# Altium project PCB_BobBreakout.PrjPcb
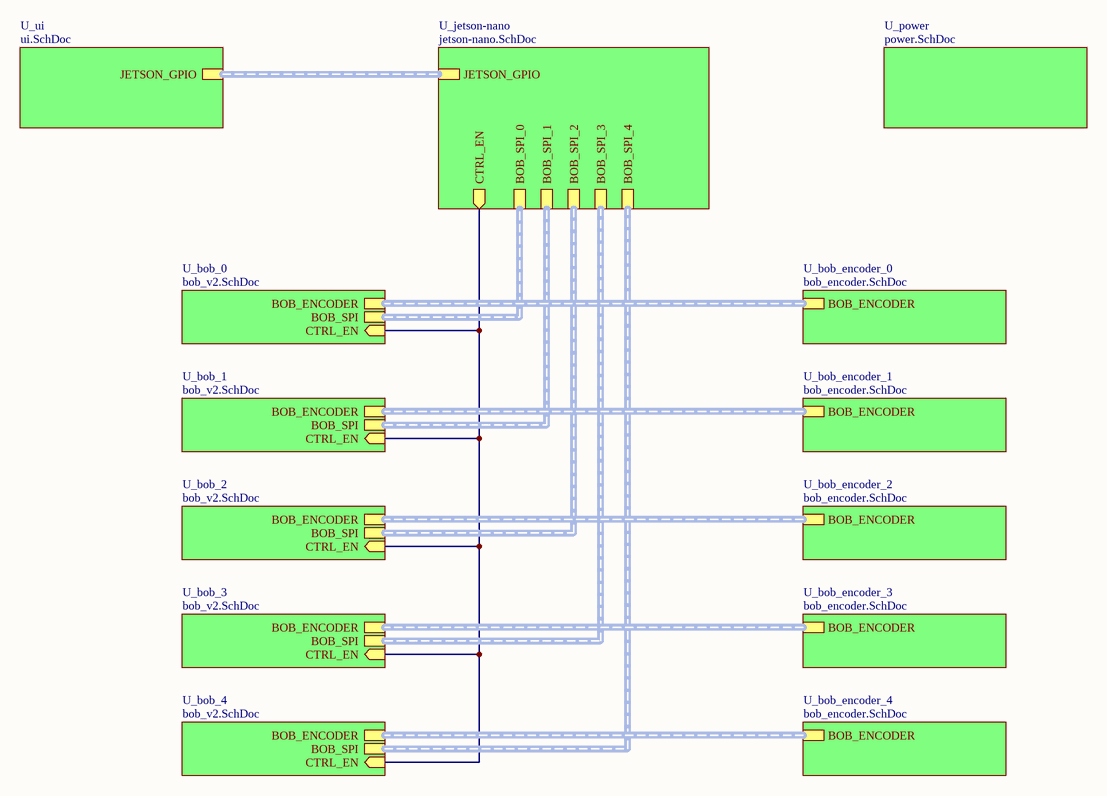
[diagram p0: bob_breakout-top.SchDoc]
8 sheets, 106 parts. Net scope: hierarchical (ports join the sheet entries above them; power ports are global).
Board file: bob_breakout-layout.PcbDoc
Sheets:
  bob_breakout-top.SchDoc
    U_jetson-nano = jetson-nano.SchDoc
      U_isolation_0 = isolation.SchDoc
      U_isolation_1 = isolation.SchDoc
      U_isolation_2 = isolation.SchDoc
      U_low-pass-filter_0 = low-pass-filter.SchDoc
      U_low-pass-filter_1 = low-pass-filter.SchDoc
      U_low-pass-filter_2 = low-pass-filter.SchDoc
      U_low-pass-filter_3 = low-pass-filter.SchDoc
      U_low-pass-filter_4 = low-pass-filter.SchDoc
      U_low-pass-filter_5 = low-pass-filter.SchDoc
      U_low-pass-filter_6 = low-pass-filter.SchDoc
      U_low-pass-filter_7 = low-pass-filter.SchDoc
      U_low-pass-filter_8 = low-pass-filter.SchDoc
      U_low-pass-filter_9 = low-pass-filter.SchDoc
    U_bob_0 = bob_v2.SchDoc
    U_bob_1 = bob_v2.SchDoc
    U_bob_2 = bob_v2.SchDoc
    U_bob_3 = bob_v2.SchDoc
    U_bob_4 = bob_v2.SchDoc
    U_power = power.SchDoc
    U_ui = ui.SchDoc
    U_bob_encoder_0 = bob_encoder.SchDoc
    U_bob_encoder_1 = bob_encoder.SchDoc
    U_bob_encoder_2 = bob_encoder.SchDoc
    U_bob_encoder_3 = bob_encoder.SchDoc
    U_bob_encoder_4 = bob_encoder.SchDoc

## Sheet bob_breakout-top.SchDoc
size A4; SheetNumber: 1; SheetTotal: 8

### Sub-sheets
U_bob_0 = bob_v2.SchDoc: BOB_SPI (harness BOB_SPI), CTRL_EN (in), BOB_ENCODER
U_bob_1 = bob_v2.SchDoc: BOB_SPI (harness BOB_SPI), CTRL_EN (in), BOB_ENCODER
U_bob_2 = bob_v2.SchDoc: BOB_SPI (harness BOB_SPI), CTRL_EN (in), BOB_ENCODER
U_bob_3 = bob_v2.SchDoc: BOB_SPI (harness BOB_SPI), CTRL_EN (in), BOB_ENCODER
U_bob_4 = bob_v2.SchDoc: BOB_SPI (harness BOB_SPI), CTRL_EN (in), BOB_ENCODER
U_bob_encoder_0 = bob_encoder.SchDoc: BOB_ENCODER
U_bob_encoder_1 = bob_encoder.SchDoc: BOB_ENCODER
U_bob_encoder_2 = bob_encoder.SchDoc: BOB_ENCODER
U_bob_encoder_3 = bob_encoder.SchDoc: BOB_ENCODER
U_bob_encoder_4 = bob_encoder.SchDoc: BOB_ENCODER
U_jetson-nano = jetson-nano.SchDoc: BOB_SPI_2 (harness BOB_SPI), BOB_SPI_0 (harness BOB_SPI), BOB_SPI_4 (harness BOB_SPI), BOB_SPI_3 (harness BOB_SPI), BOB_SPI_1 (harness BOB_SPI), JETSON_GPIO (harness JETSON_GPIO), CTRL_EN (out)
U_power = power.SchDoc: no entries
U_ui = ui.SchDoc: JETSON_GPIO (harness JETSON_GPIO)

### Nets
CTRL_EN: sheet U_jetson-nano/CTRL_EN, sheet U_bob_0/CTRL_EN, sheet U_bob_1/CTRL_EN, sheet U_bob_2/CTRL_EN, sheet U_bob_3/CTRL_EN, sheet U_bob_4/CTRL_EN

### Buses and harness runs
harness sheet U_bob_0/BOB_ENCODER = sheet U_bob_encoder_0/BOB_ENCODER
harness sheet U_bob_0/BOB_SPI = sheet U_jetson-nano/BOB_SPI_0
harness sheet U_bob_1/BOB_ENCODER = sheet U_bob_encoder_1/BOB_ENCODER
harness sheet U_bob_1/BOB_SPI = sheet U_jetson-nano/BOB_SPI_1
harness sheet U_bob_2/BOB_ENCODER = sheet U_bob_encoder_2/BOB_ENCODER
harness sheet U_bob_2/BOB_SPI = sheet U_jetson-nano/BOB_SPI_2
harness sheet U_bob_3/BOB_ENCODER = sheet U_bob_encoder_3/BOB_ENCODER
harness sheet U_bob_3/BOB_SPI = sheet U_jetson-nano/BOB_SPI_3
harness sheet U_bob_4/BOB_ENCODER = sheet U_bob_encoder_4/BOB_ENCODER
harness sheet U_bob_4/BOB_SPI = sheet U_jetson-nano/BOB_SPI_4
harness sheet U_jetson-nano/JETSON_GPIO = sheet U_ui/JETSON_GPIO

## Sheet jetson-nano.SchDoc
size A3; SheetNumber: 2; SheetTotal: 8
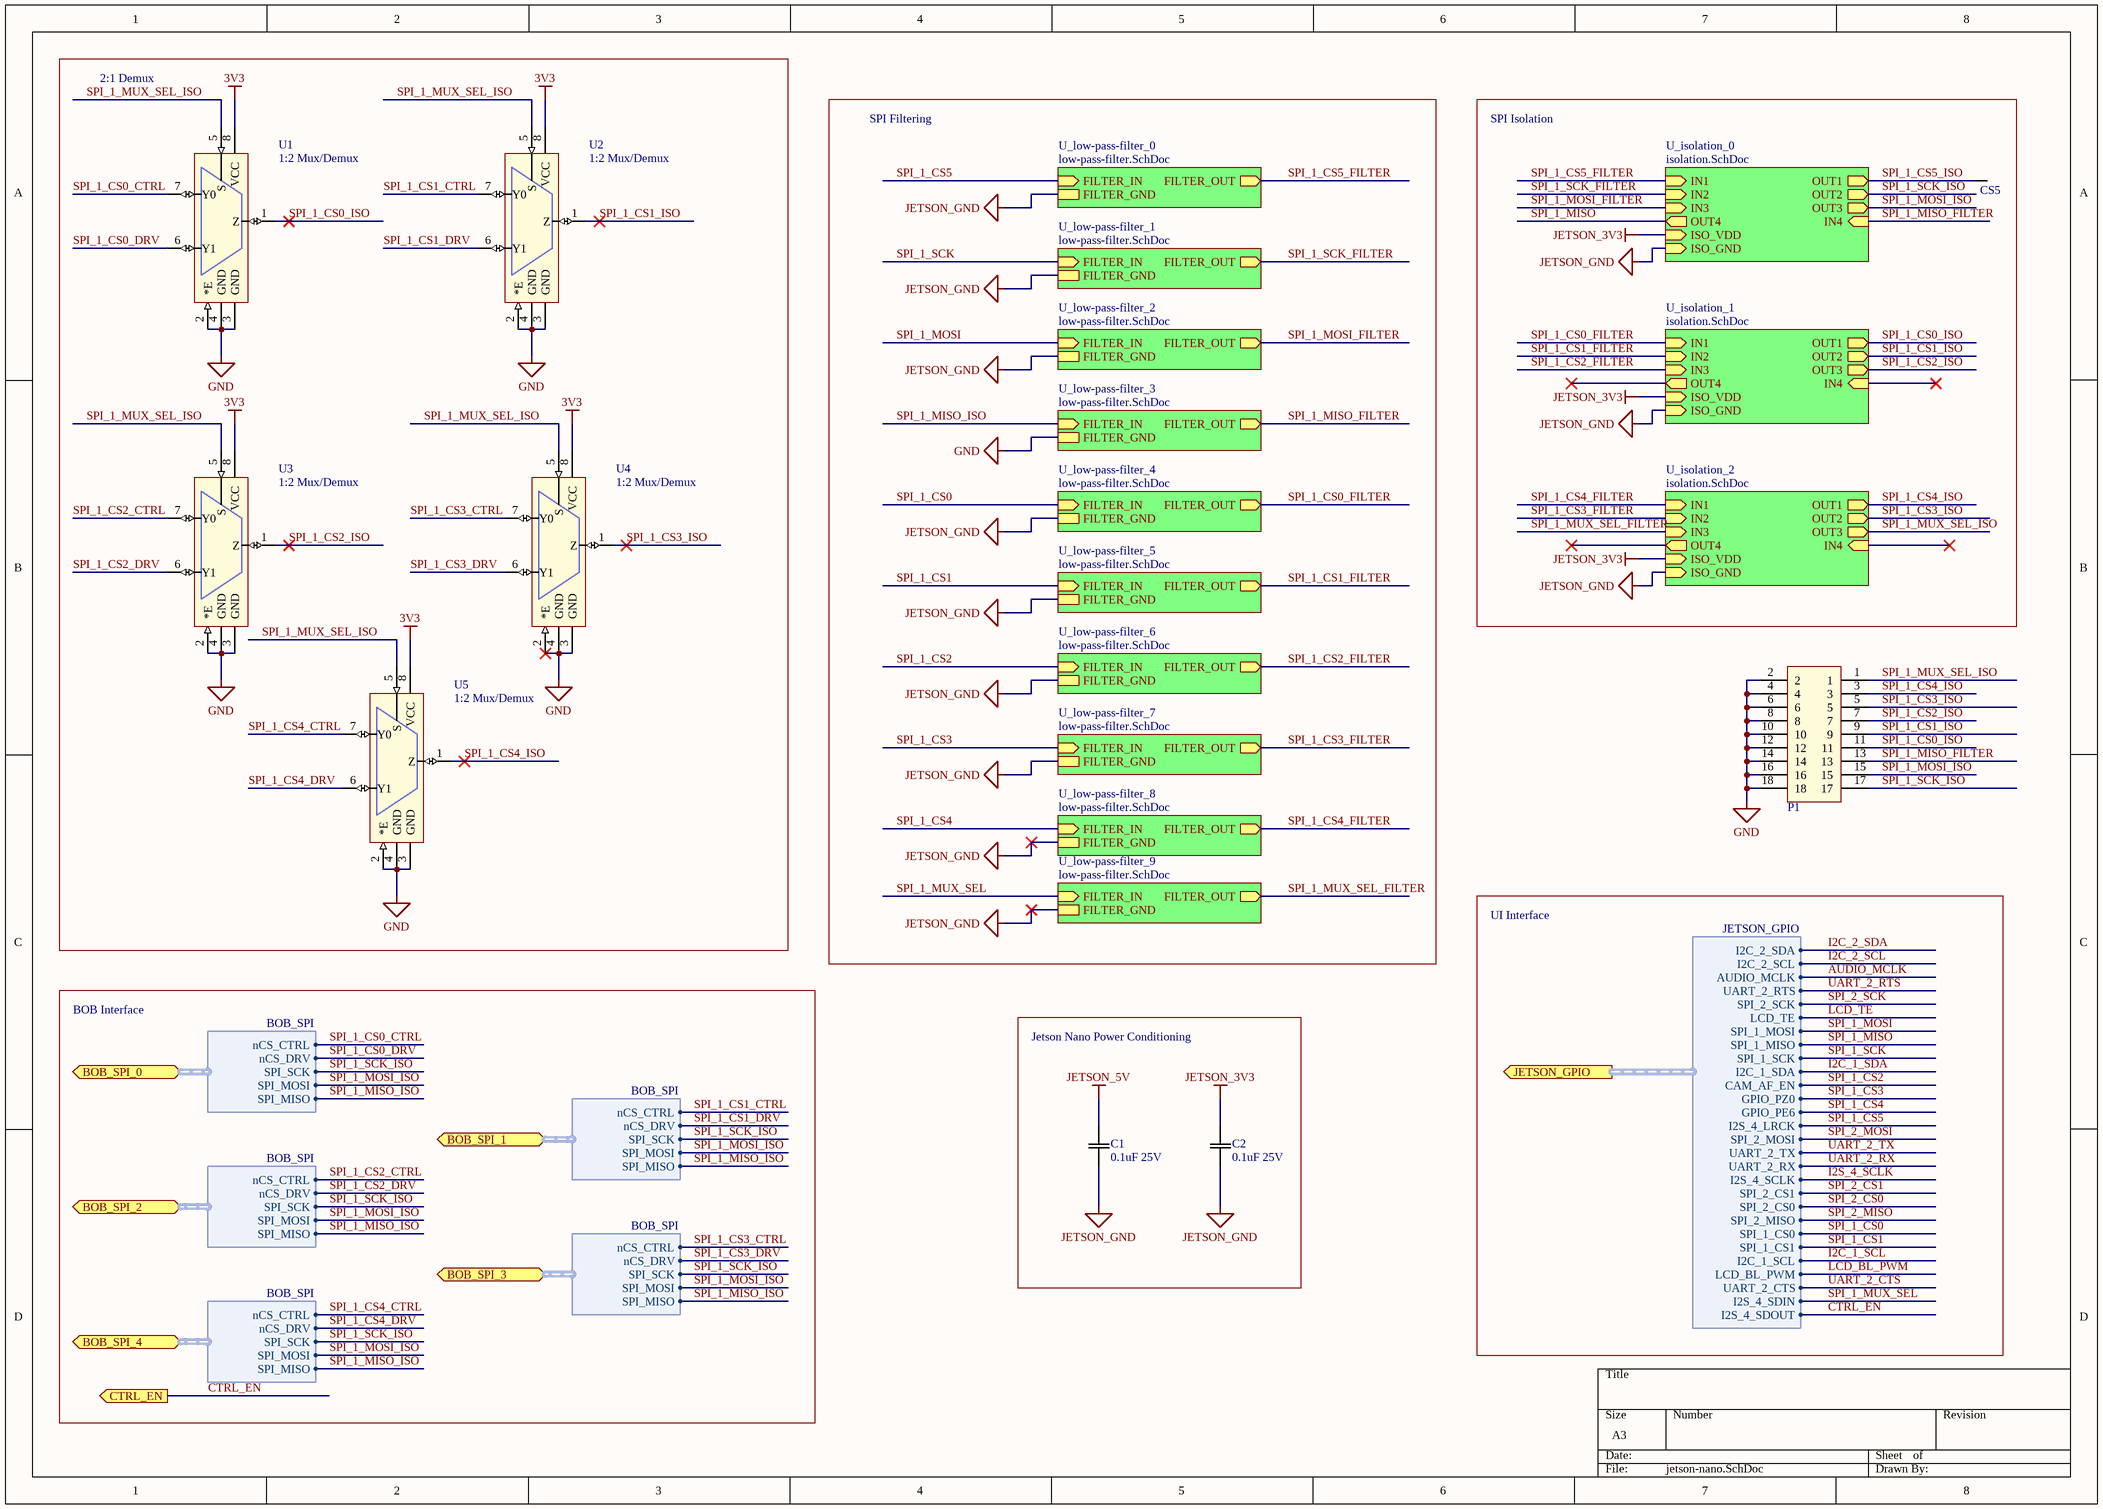
[diagram p1: jetson-nano.SchDoc]

### Parts
C1  0.1uF 25V  [0805]
C2  0.1uF 25V  [0805]
CS5  Test Point (Via)  [TP]  (value not drawn)
P1  CN HDR 18POS 2x9  [HDR2x9]  (value not drawn)
U1  1:2 Mux/Demux  [TSOP65P400X110-8N]
U2  1:2 Mux/Demux  [TSOP65P400X110-8N]
U3  1:2 Mux/Demux  [TSOP65P400X110-8N]
U4  1:2 Mux/Demux  [TSOP65P400X110-8N]
U5  1:2 Mux/Demux  [TSOP65P400X110-8N]

### Blocks framed on the sheet
2:1 Demux: U1-U5
SPI Isolation: CS5
Jetson Nano Power Conditioning: C1 C2

### Sub-sheets
U_isolation_0 = isolation.SchDoc: OUT1 (out), IN1 (in), IN2 (in), IN3 (in), OUT4 (out), OUT3 (out), OUT2 (out), IN4 (in), ISO_VDD (in), ISO_GND (in)
U_isolation_1 = isolation.SchDoc: OUT1 (out), IN1 (in), IN2 (in), IN3 (in), OUT4 (out), OUT3 (out), OUT2 (out), IN4 (in), ISO_VDD (in), ISO_GND (in)
U_isolation_2 = isolation.SchDoc: OUT1 (out), IN1 (in), IN2 (in), IN3 (in), OUT4 (out), OUT3 (out), OUT2 (out), IN4 (in), ISO_VDD (in), ISO_GND (in)
U_low-pass-filter_0 = low-pass-filter.SchDoc: FILTER_OUT (out), FILTER_IN (in), FILTER_GND
U_low-pass-filter_1 = low-pass-filter.SchDoc: FILTER_OUT (out), FILTER_IN (in), FILTER_GND
U_low-pass-filter_2 = low-pass-filter.SchDoc: FILTER_OUT (out), FILTER_IN (in), FILTER_GND
U_low-pass-filter_3 = low-pass-filter.SchDoc: FILTER_OUT (out), FILTER_IN (in), FILTER_GND
U_low-pass-filter_4 = low-pass-filter.SchDoc: FILTER_OUT (out), FILTER_IN (in), FILTER_GND
U_low-pass-filter_5 = low-pass-filter.SchDoc: FILTER_OUT (out), FILTER_IN (in), FILTER_GND
U_low-pass-filter_6 = low-pass-filter.SchDoc: FILTER_OUT (out), FILTER_IN (in), FILTER_GND
U_low-pass-filter_7 = low-pass-filter.SchDoc: FILTER_OUT (out), FILTER_IN (in), FILTER_GND
U_low-pass-filter_8 = low-pass-filter.SchDoc: FILTER_OUT (out), FILTER_IN (in), FILTER_GND
U_low-pass-filter_9 = low-pass-filter.SchDoc: FILTER_OUT (out), FILTER_IN (in), FILTER_GND

### Ports
BOB_SPI_0 (bidir, harness BOB_SPI), BOB_SPI_1 (bidir, harness BOB_SPI), BOB_SPI_2 (bidir, harness BOB_SPI), BOB_SPI_3 (bidir, harness BOB_SPI), BOB_SPI_4 (bidir, harness BOB_SPI), CTRL_EN (out), JETSON_GPIO (out, harness JETSON_GPIO)

### Harnesses
BOB_SPI: nCS_CTRL, nCS_DRV, SPI_SCK, SPI_MOSI, SPI_MISO
JETSON_GPIO: I2C_2_SDA, I2C_2_SCL, AUDIO_MCLK, UART_2_RTS, SPI_2_SCK, LCD_TE, SPI_1_MOSI, SPI_1_MISO, SPI_1_SCK, I2C_1_SDA, CAM_AF_EN, GPIO_PZ0, GPIO_PE6, I2S_4_LRCK, SPI_2_MOSI, UART_2_TX, UART_2_RX, I2S_4_SCLK, SPI_2_CS1, SPI_2_CS0, SPI_2_MISO, SPI_1_CS0, SPI_1_CS1, I2C_1_SCL, LCD_BL_PWM, UART_2_CTS, I2S_4_SDIN, I2S_4_SDOUT

### Nets
3V3: U1.8(VCC) U2.8(VCC) U3.8(VCC) U4.8(VCC) U5.8(VCC)
GND: P1.2 P1.4 P1.6 P1.8 P1.10 P1.12 P1.14 P1.16 P1.18 U1.2(*E) U1.3(GND) U1.4(GND) U2.2(*E) U2.3(GND) U2.4(GND) U3.2(*E) U3.3(GND) U3.4(GND) U4.2(*E) U4.3(GND) U4.4(GND) U5.2(*E) U5.3(GND) U5.4(GND) ; sheet U_low-pass-filter_3/FILTER_GND
JETSON_3V3: C2.1(C1) ; sheet U_isolation_0/ISO_VDD, sheet U_isolation_1/ISO_VDD, sheet U_isolation_2/ISO_VDD
JETSON_5V: C1.1(C1)
JETSON_GND: C1.2(C2) C2.2(C2) ; sheet U_isolation_0/ISO_GND, sheet U_isolation_1/ISO_GND, sheet U_isolation_2/ISO_GND, sheet U_low-pass-filter_0/FILTER_GND, sheet U_low-pass-filter_1/FILTER_GND, sheet U_low-pass-filter_2/FILTER_GND, sheet U_low-pass-filter_4/FILTER_GND, sheet U_low-pass-filter_5/FILTER_GND, sheet U_low-pass-filter_6/FILTER_GND, sheet U_low-pass-filter_7/FILTER_GND, sheet U_low-pass-filter_8/FILTER_GND, sheet U_low-pass-filter_9/FILTER_GND
CTRL_EN: port CTRL_EN, port JETSON_GPIO.I2S_4_SDOUT
SPI_1_CS0: sheet U_low-pass-filter_4/FILTER_IN, port JETSON_GPIO.SPI_1_CS0
SPI_1_CS0_CTRL: U1.7(Y0) ; port BOB_SPI_0.nCS_CTRL
SPI_1_CS0_DRV: U1.6(Y1) ; port BOB_SPI_0.nCS_DRV
SPI_1_CS0_FILTER: sheet U_isolation_1/IN1, sheet U_low-pass-filter_4/FILTER_OUT
SPI_1_CS0_ISO: P1.11 U1.1(Z) ; sheet U_isolation_1/OUT1
SPI_1_CS1: sheet U_low-pass-filter_5/FILTER_IN, port JETSON_GPIO.SPI_1_CS1
SPI_1_CS1_CTRL: U2.7(Y0) ; port BOB_SPI_1.nCS_CTRL
SPI_1_CS1_DRV: U2.6(Y1) ; port BOB_SPI_1.nCS_DRV
SPI_1_CS1_FILTER: sheet U_isolation_1/IN2, sheet U_low-pass-filter_5/FILTER_OUT
SPI_1_CS1_ISO: P1.9 U2.1(Z) ; sheet U_isolation_1/OUT2
SPI_1_CS2: sheet U_low-pass-filter_6/FILTER_IN, port JETSON_GPIO.CAM_AF_EN  [project net CAM_AF_EN]
SPI_1_CS2_CTRL: U3.7(Y0) ; port BOB_SPI_2.nCS_CTRL
SPI_1_CS2_DRV: U3.6(Y1) ; port BOB_SPI_2.nCS_DRV
SPI_1_CS2_FILTER: sheet U_isolation_1/IN3, sheet U_low-pass-filter_6/FILTER_OUT
SPI_1_CS2_ISO: P1.7 U3.1(Z) ; sheet U_isolation_1/OUT3
SPI_1_CS3: sheet U_low-pass-filter_7/FILTER_IN, port JETSON_GPIO.GPIO_PZ0  [project net GPIO_PZ0]
SPI_1_CS3_CTRL: U4.7(Y0) ; port BOB_SPI_3.nCS_CTRL
SPI_1_CS3_DRV: U4.6(Y1) ; port BOB_SPI_3.nCS_DRV
SPI_1_CS3_FILTER: sheet U_isolation_2/IN2, sheet U_low-pass-filter_7/FILTER_OUT
SPI_1_CS3_ISO: P1.5 U4.1(Z) ; sheet U_isolation_2/OUT2
SPI_1_CS4: sheet U_low-pass-filter_8/FILTER_IN, port JETSON_GPIO.GPIO_PE6  [project net GPIO_PE6]
SPI_1_CS4_CTRL: U5.7(Y0) ; port BOB_SPI_4.nCS_CTRL
SPI_1_CS4_DRV: U5.6(Y1) ; port BOB_SPI_4.nCS_DRV
SPI_1_CS4_FILTER: sheet U_isolation_2/IN1, sheet U_low-pass-filter_8/FILTER_OUT
SPI_1_CS4_ISO: P1.3 U5.1(Z) ; sheet U_isolation_2/OUT1
SPI_1_CS5: sheet U_low-pass-filter_0/FILTER_IN, port JETSON_GPIO.I2S_4_LRCK  [project net I2S_4_LRCK]
SPI_1_CS5_FILTER: sheet U_isolation_0/IN1, sheet U_low-pass-filter_0/FILTER_OUT
SPI_1_CS5_ISO: CS5.1 ; sheet U_isolation_0/OUT1
SPI_1_MISO: sheet U_isolation_0/OUT4, port JETSON_GPIO.SPI_1_MISO
SPI_1_MISO_FILTER: P1.13 ; sheet U_isolation_0/IN4, sheet U_low-pass-filter_3/FILTER_OUT
SPI_1_MISO_ISO: sheet U_low-pass-filter_3/FILTER_IN, port BOB_SPI_0.SPI_MISO, port BOB_SPI_2.SPI_MISO, port BOB_SPI_1.SPI_MISO, port BOB_SPI_3.SPI_MISO, port BOB_SPI_4.SPI_MISO
SPI_1_MOSI: sheet U_low-pass-filter_2/FILTER_IN, port JETSON_GPIO.SPI_1_MOSI
SPI_1_MOSI_FILTER: sheet U_isolation_0/IN3, sheet U_low-pass-filter_2/FILTER_OUT
SPI_1_MOSI_ISO: P1.15 ; sheet U_isolation_0/OUT3, port BOB_SPI_0.SPI_MOSI, port BOB_SPI_2.SPI_MOSI, port BOB_SPI_1.SPI_MOSI, port BOB_SPI_3.SPI_MOSI, port BOB_SPI_4.SPI_MOSI
SPI_1_MUX_SEL: sheet U_low-pass-filter_9/FILTER_IN, port JETSON_GPIO.I2S_4_SDIN  [project net I2S_4_SDIN]
SPI_1_MUX_SEL_FILTER: sheet U_isolation_2/IN3, sheet U_low-pass-filter_9/FILTER_OUT
SPI_1_MUX_SEL_ISO: P1.1 U1.5(S) U2.5(S) U3.5(S) U4.5(S) U5.5(S) ; sheet U_isolation_2/OUT3
SPI_1_SCK: sheet U_low-pass-filter_1/FILTER_IN, port JETSON_GPIO.SPI_1_SCK
SPI_1_SCK_FILTER: sheet U_isolation_0/IN2, sheet U_low-pass-filter_1/FILTER_OUT
SPI_1_SCK_ISO: P1.17 ; sheet U_isolation_0/OUT2, port BOB_SPI_0.SPI_SCK, port BOB_SPI_2.SPI_SCK, port BOB_SPI_1.SPI_SCK, port BOB_SPI_3.SPI_SCK, port BOB_SPI_4.SPI_SCK

### Notes on the sheet
- SPI Filtering
- UI Interface
- BOB Interface

### Library data of the parts
C1 C2 = CAP 0.1uF 25V: CAP CER 0.1UF 25V X7R 0805/0603; Tolerance: 10%; Value: 0.1uF; Temperature Coefficient: X7R; Rating: 25V; Operating Temperature: -55°C ~ 125°C
U1-U5 = 74LVC1G53DP,125: 74LVC Series 5.5 V SMT 2-Channel Analog Multiplexer/Demultiplexer - TSSOP-8; Manufacturer: NXP Semiconductors; Min Supply Voltage: 1.65V; Max Supply Voltage: 5.5V; Number of Channels: 2; Bandwidth: 300MHz; Propagation Delay: 0.8ns; Max Power Dissipation: 250mW; On-State Resistance: 15R; Turn-On Delay Time: 6.7ns; Turn-Off Delay Time: 6.8ns; Operating Supply Current: 40uA; Number of Outputs: 1; Logic Function: Multiplexer,Demultiplexer,Mux,Demux; Supply Type: Single; Supplier 1: Digi-Key; Manufacturer Part Number: 74LVC1G53DP,125; RoHS: Yes; Category: Decoders and Multiplexers; Mount: Surface Mount; Case/Package: TSSOP; Number of Pins: 8; Min Operating Temperature: -40°C; Max Operating Temperature: 125°C; Packaging: Tape and Reel; Package Quantity: 3000; Number of Inputs: 2; Power Dissipation: 250mW; Number of Circuits: 1; Number of Switches: 1; Series: 74LVC; Number of Functions: 1; Supply Voltage-Nom: 5.5V; Radiation Hardening: No; RoHS Compliant: Yes; REACH SVHC: No SVHC; Lead Free: Lead Free; ComponentLink1URL: https://datasheet.ciiva.com/2979/74lvc1g53-2979089.pdf?src-supplier=Arrow+Electronics; ComponentLink1Description: https://datasheet.ciiva.com/2979/74lvc1g53-2979089.pdf?src-supplier=Arrow+Electronics; ComponentLink2URL: https://datasheet.ciiva.com/2979/74lvc1g53-2979091.pdf?src-supplier=Avnet; ComponentLink2Description: https://datasheet.ciiva.com/2979/74lvc1g53-2979091.pdf?src-supplier=Avnet; ComponentLink3URL: https://datasheet.ciiva.com/2980/74lvc1g53-2980513.pdf?src-supplier=Avnet; ComponentLink3Description: https://datasheet.ciiva.com/2980/74lvc1g53-2980513.pdf?src-supplier=Avnet; ComponentLink4URL: https://datasheet.ciiva.com/1667/74lvc1g53-1667421.pdf?src-supplier=Digi-Key; ComponentLink4Description: https://datasheet.ciiva.com/1667/74lvc1g53-1667421.pdf?src-supplier=Digi-Key; ComponentLink5URL: https://datasheet.ciiva.com/1667/74lvc1g53-1667422.pdf?src-supplier=Digi-Key; ComponentLink5Description: https://datasheet.ciiva.com/1667/74lvc1g53-1667422.pdf?src-supplier=Digi-Key; ComponentLink6URL: https://datasheet.ciiva.com/1667/74lvc1g53-1667423.pdf?src-supplier=Digi-Key; ComponentLink6Description: https://datasheet.ciiva.com/1667/74lvc1g53-1667423.pdf?src-supplier=Digi-Key; ComponentLink7URL: https://datasheet.ciiva.com/16393/74lvc1g53-16393237.pdf?src-supplier=Future+Electronics; ComponentLink7Description: https://datasheet.ciiva.com/16393/74lvc1g53-16393237.pdf?src-supplier=Future+Electronics; ComponentLink8URL: https://datasheet.ciiva.com/46404/1759244-46404166.pdf?src-supplier=Element14; ComponentLink8Description: https://datasheet.ciiva.com/46404/1759244-46404166.pdf?src-supplier=Element14; Supplier Part Number 1: 1727-6078-1-ND

## Sheet isolation.SchDoc
size A4; SheetNumber: 3; SheetTotal: 8
Used 3 times, as channels U_jetson-nano/U_isolation_0, U_jetson-nano/U_isolation_1, U_jetson-nano/U_isolation_2. Parts and nets are listed once, with the designators drawn on the sheet.
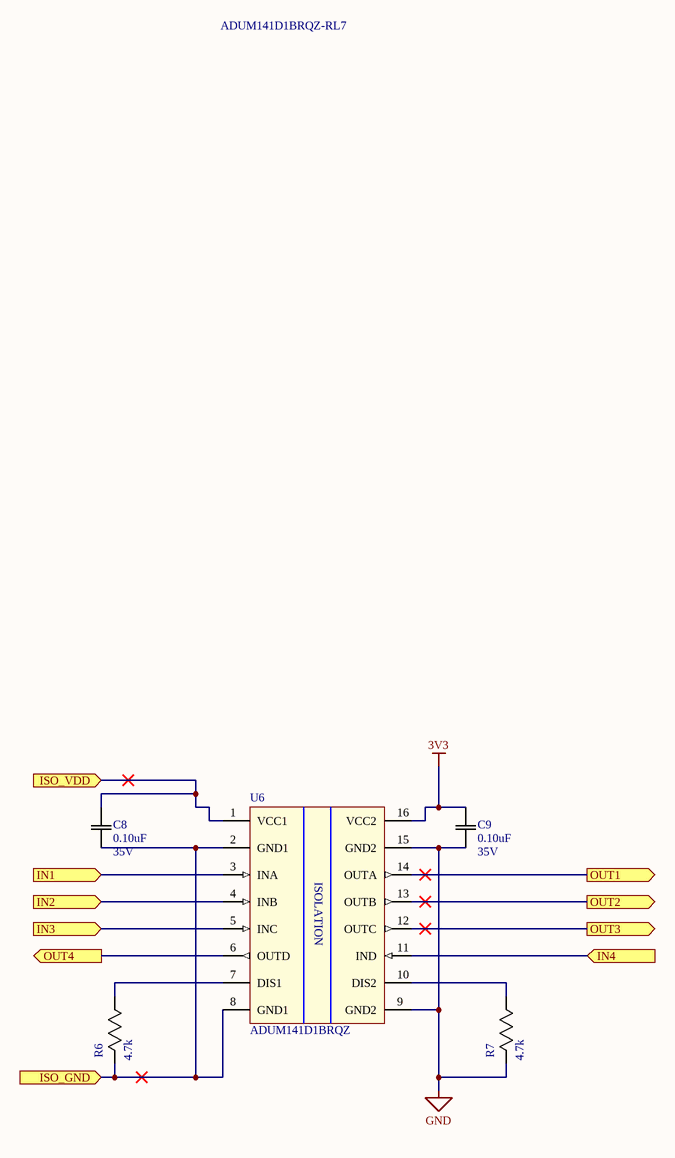
[diagram p2: isolation.SchDoc]

### Parts
C8  Rating: 35V  [0603]  (hidden comment: 0.10uF)
C9  Rating: 35V  [0603]  (hidden comment: 0.10uF)
R6  4.7k  [0603]
R7  4.7k  [0603]
U6  ADUM141D1BRQZ  Supplier Part Number 1: ADUM141D1BRQZ-RL7  [SOP64P600X175-16N]

### Ports
IN1 (in), IN2 (in), IN3 (in), IN4 (in), ISO_GND (in), ISO_VDD (in), OUT1 (out), OUT2 (out), OUT3 (out), OUT4 (out)

### Nets
3V3: C9.2(C2) U6.16(VCC2)
GND: C9.1(C1) R7.2(R2) U6.9(GND2) U6.15(GND2)
IN1: U6.3(INA) ; port IN1
IN2: U6.4(INB) ; port IN2
IN3: U6.5(INC) ; port IN3
IN4: U6.11(IND) ; port IN4
ISO_GND: C8.1(C1) R6.2(R2) U6.2(GND1) U6.8(GND1) ; port ISO_GND
ISO_VDD: C8.2(C2) U6.1(VCC1) ; port ISO_VDD
OUT1: U6.14(OUTA) ; port OUT1
OUT2: U6.13(OUTB) ; port OUT2
OUT3: U6.12(OUTC) ; port OUT3
OUT4: U6.6(OUTD) ; port OUT4
NetR6_1: R6.1(R1) U6.7(DIS1)
NetR7_1: R7.1(R1) U6.10(DIS2)

### Channels
U_jetson-nano/U_isolation_0: designators end in _1; ports IN1=SPI_1_CS5_FILTER IN2=SPI_1_SCK_FILTER IN3=SPI_1_MOSI_FILTER IN4=SPI_1_MISO_FILTER ISO_GND=JETSON_GND ISO_VDD=JETSON_3V3 OUT1=SPI_1_CS5_ISO OUT2=SPI_1_SCK_ISO OUT3=SPI_1_MOSI_ISO OUT4=SPI_1_MISO
U_jetson-nano/U_isolation_1: designators end in _2; ports IN1=SPI_1_CS0_FILTER IN2=SPI_1_CS1_FILTER IN3=SPI_1_CS2_FILTER IN4=NetU6_2_11 ISO_GND=JETSON_GND ISO_VDD=JETSON_3V3 OUT1=SPI_1_CS0_ISO OUT2=SPI_1_CS1_ISO OUT3=SPI_1_CS2_ISO OUT4=NetU6_2_6
U_jetson-nano/U_isolation_2: designators end in _3; ports IN1=SPI_1_CS4_FILTER IN2=SPI_1_CS3_FILTER IN3=SPI_1_MUX_SEL_FILTER IN4=NetU6_3_11 ISO_GND=JETSON_GND ISO_VDD=JETSON_3V3 OUT1=SPI_1_CS4_ISO OUT2=SPI_1_CS3_ISO OUT3=SPI_1_MUX_SEL_ISO OUT4=NetU6_3_6

### Notes on the sheet
- (in symbol ISO ADUM141D1BRQZ) ISOLATION

### Library data of the parts
C8 C9 = CAP 0.10uF 35V: CAP CER 0.10UF 35V X7R 0603/0805; Tolerance: 10%; Package: 0603/0805; Temperature Coefficient: X7R; Operating Temperature: -55°C ~ 125°C; Value: 0.10uF
R6 R7 = RES 4.7k 1/8W - 5%: RES SMD 4.7k OHM 5% 1/8W 0805; Power (Watts): 0.125W; Package: 0805; Value: 4.7k; Tolerance: 5%
U6 = ISO ADUM141D1BRQZ: Digital Isolator CMOS 4-CH 150Mbps 16-Pin QSOP T/R; Manufacturer: Analog Devices; Isolated Power: No; Number of Channels: 4; Channel Type: Unidirectional; Propagation Delay: 13ns; Pulse Width Distortion (PWD): 3ns; Supplier 1: Arrow Electronics; Manufacturer Part Number: ADUM141D1BRQZ-RL7; RoHS: Yes; Category: Interface ICs; Stock 1: 341; Pricing 1: 1=3.87700, 10=3.47000, 25=3.26100, 50=3.22900, 100=2.78500, 250=2.67500 (USD); Mount: Surface Mount; Case/Package: SSOP; Number of Pins: 16; Min Operating Temperature: -40°C; Max Operating Temperature: 125°C; Type: General Purpose; Packaging: Tape and Reel; Data Rate: 150Mbps; RoHS Compliant: Yes; ComponentLink1URL: https://www.analog.com/media/en/technical-documentation/data-sheets/ADuM140D_140E_141D_141E_142D_142E.pdf?src-supplier=Digi-Key; ComponentLink1Description: https://www.analog.com/media/en/technical-documentation/data-sheets/ADuM140D_140E_141D_141E_142D_142E.pdf?src-supplier=Digi-Key

## Sheet low-pass-filter.SchDoc
size A4; SheetNumber: 4; SheetTotal: 8
Used 10 times, as channels U_jetson-nano/U_low-pass-filter_0, U_jetson-nano/U_low-pass-filter_1, U_jetson-nano/U_low-pass-filter_2, U_jetson-nano/U_low-pass-filter_3, U_jetson-nano/U_low-pass-filter_4, U_jetson-nano/U_low-pass-filter_5, U_jetson-nano/U_low-pass-filter_6, U_jetson-nano/U_low-pass-filter_7, U_jetson-nano/U_low-pass-filter_8, U_jetson-nano/U_low-pass-filter_9. Parts and nets are listed once, with the designators drawn on the sheet.
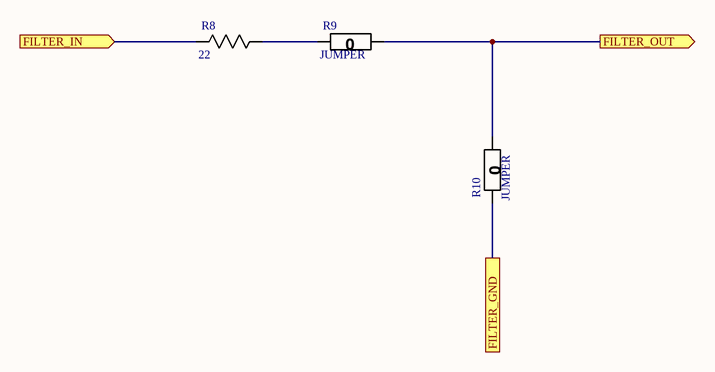
[diagram p3: low-pass-filter.SchDoc]

### Parts
R8  22  [0805]
R9  JUMPER  [0805]
R10  JUMPER  [0805]

### Ports
FILTER_GND, FILTER_IN (in), FILTER_OUT (out)

### Nets
FILTER_GND: R10.2(R2) ; port FILTER_GND
FILTER_IN: R8.2(R2) ; port FILTER_IN
FILTER_OUT: R9.1(R1) R10.1(R1) ; port FILTER_OUT
NetR8_1: R8.1(R1) R9.2(R2)

### Channels
U_jetson-nano/U_low-pass-filter_0: designators end in _1; ports FILTER_GND=JETSON_GND FILTER_IN=I2S_4_LRCK FILTER_OUT=SPI_1_CS5_FILTER
U_jetson-nano/U_low-pass-filter_1: designators end in _2; ports FILTER_GND=JETSON_GND FILTER_IN=SPI_1_SCK FILTER_OUT=SPI_1_SCK_FILTER
U_jetson-nano/U_low-pass-filter_2: designators end in _3; ports FILTER_GND=JETSON_GND FILTER_IN=SPI_1_MOSI FILTER_OUT=SPI_1_MOSI_FILTER
U_jetson-nano/U_low-pass-filter_3: designators end in _4; ports FILTER_GND=GND FILTER_IN=SPI_1_MISO_ISO FILTER_OUT=SPI_1_MISO_FILTER
U_jetson-nano/U_low-pass-filter_4: designators end in _5; ports FILTER_GND=JETSON_GND FILTER_IN=SPI_1_CS0 FILTER_OUT=SPI_1_CS0_FILTER
U_jetson-nano/U_low-pass-filter_5: designators end in _6; ports FILTER_GND=JETSON_GND FILTER_IN=SPI_1_CS1 FILTER_OUT=SPI_1_CS1_FILTER
U_jetson-nano/U_low-pass-filter_6: designators end in _7; ports FILTER_GND=JETSON_GND FILTER_IN=CAM_AF_EN FILTER_OUT=SPI_1_CS2_FILTER
U_jetson-nano/U_low-pass-filter_7: designators end in _8; ports FILTER_GND=JETSON_GND FILTER_IN=GPIO_PZ0 FILTER_OUT=SPI_1_CS3_FILTER
U_jetson-nano/U_low-pass-filter_8: designators end in _9; ports FILTER_GND=JETSON_GND FILTER_IN=GPIO_PE6 FILTER_OUT=SPI_1_CS4_FILTER
U_jetson-nano/U_low-pass-filter_9: designators end in _10; ports FILTER_GND=JETSON_GND FILTER_IN=I2S_4_SDIN FILTER_OUT=SPI_1_MUX_SEL_FILTER

### Library data of the parts
R8 = RES 22.0 1/8W: RES SMD 22 OHM 5% 1/8W 0805; Power (Watts): 0.125W; Package: 0805; Value: 22; Tolerance: 5%
R9 R10 = RES 0 JUMPER: RES SMD 0 OHM JUMPER GENERIC 0805/0603; Value: 0; Package: 0805

## Sheet bob_v2.SchDoc
size A4; SheetNumber: 7; SheetTotal: 8
Used 5 times, as channels U_bob_0, U_bob_1, U_bob_2, U_bob_3, U_bob_4. Parts and nets are listed once, with the designators drawn on the sheet.
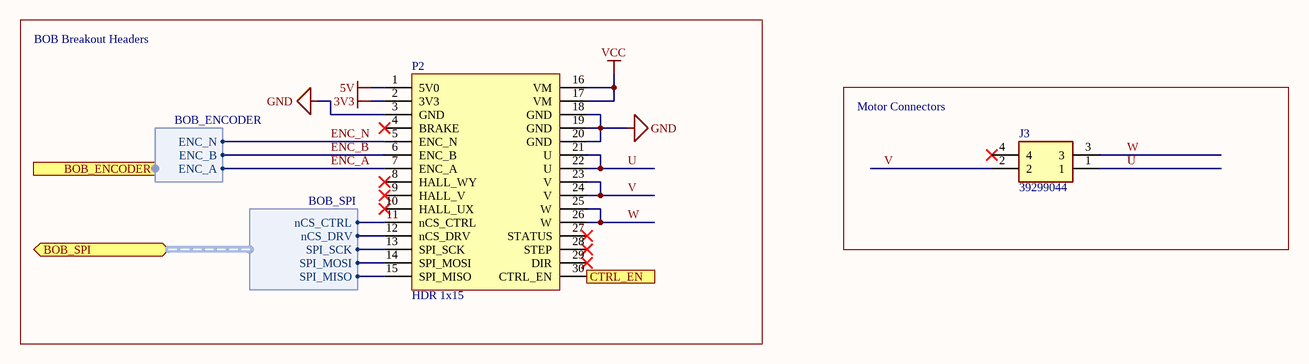
[diagram p4: bob_v2.SchDoc]

### Parts
J3  39299044  [39299044]
P2  HDR 1x15  [TRINAMIC_BOB]

### Blocks framed on the sheet
BOB Breakout Headers: P2
Motor Connectors: J3

### Ports
BOB_ENCODER (harness BOB_ENCODER), BOB_SPI (bidir, harness BOB_SPI), CTRL_EN (in)

### Harnesses
BOB_SPI: nCS_CTRL, nCS_DRV, SPI_SCK, SPI_MOSI, SPI_MISO
BOB_ENCODER: ENC_A, ENC_B, ENC_N

### Nets
3V3: P2.2(3V3)
5V: P2.1(5V0)
GND: P2.3(GND) P2.18(GND) P2.19(GND) P2.20(GND)
VCC: P2.16(VM) P2.17(VM)
CTRL_EN: P2.30(CTRL_EN) ; port CTRL_EN
ENC_A: P2.7(ENC_A) ; port BOB_ENCODER.ENC_A
ENC_B: P2.6(ENC_B) ; port BOB_ENCODER.ENC_B
ENC_N: P2.5(ENC_N) ; port BOB_ENCODER.ENC_N
U: J3.1 P2.21(U) P2.22(U)
V: J3.2 P2.23(V) P2.24(V)
W: J3.3 P2.25(W) P2.26(W)
NetP2_11: P2.11(nCS_CTRL) ; port BOB_SPI.nCS_CTRL
NetP2_12: P2.12(nCS_DRV) ; port BOB_SPI.nCS_DRV
NetP2_13: P2.13(SPI_SCK) ; port BOB_SPI.SPI_SCK
NetP2_14: P2.14(SPI_MOSI) ; port BOB_SPI.SPI_MOSI
NetP2_15: P2.15(SPI_MISO) ; port BOB_SPI.SPI_MISO

Not connected (* = marked no-connect by the designer): J3 4*; P2 4(BRAKE)* 8(HALL_WY)* 9(HALL_V)* 10(HALL_UX)* 27(STATUS)* 28(STEP)* 29(DIR)*

### Channels
U_bob_0: designators end in _1; ports CTRL_EN=CTRL_EN
U_bob_1: designators end in _2; ports CTRL_EN=CTRL_EN
U_bob_2: designators end in _3; ports CTRL_EN=CTRL_EN
U_bob_3: designators end in _4; ports CTRL_EN=CTRL_EN
U_bob_4: designators end in _5; ports CTRL_EN=CTRL_EN

### Library data of the parts
J3 = CN HDR 4POS Molex CN HDR 4POS Molex 39299044 VERT: Molex 39299044 4POS Minifit / dual row, vertical; Supplier 1: Digi-Key; Supplier Part Number 1: WM7336-ND
P2 = TRINAMIC_BOB

## Sheet power.SchDoc
size A4; SheetNumber: 5; SheetTotal: 8
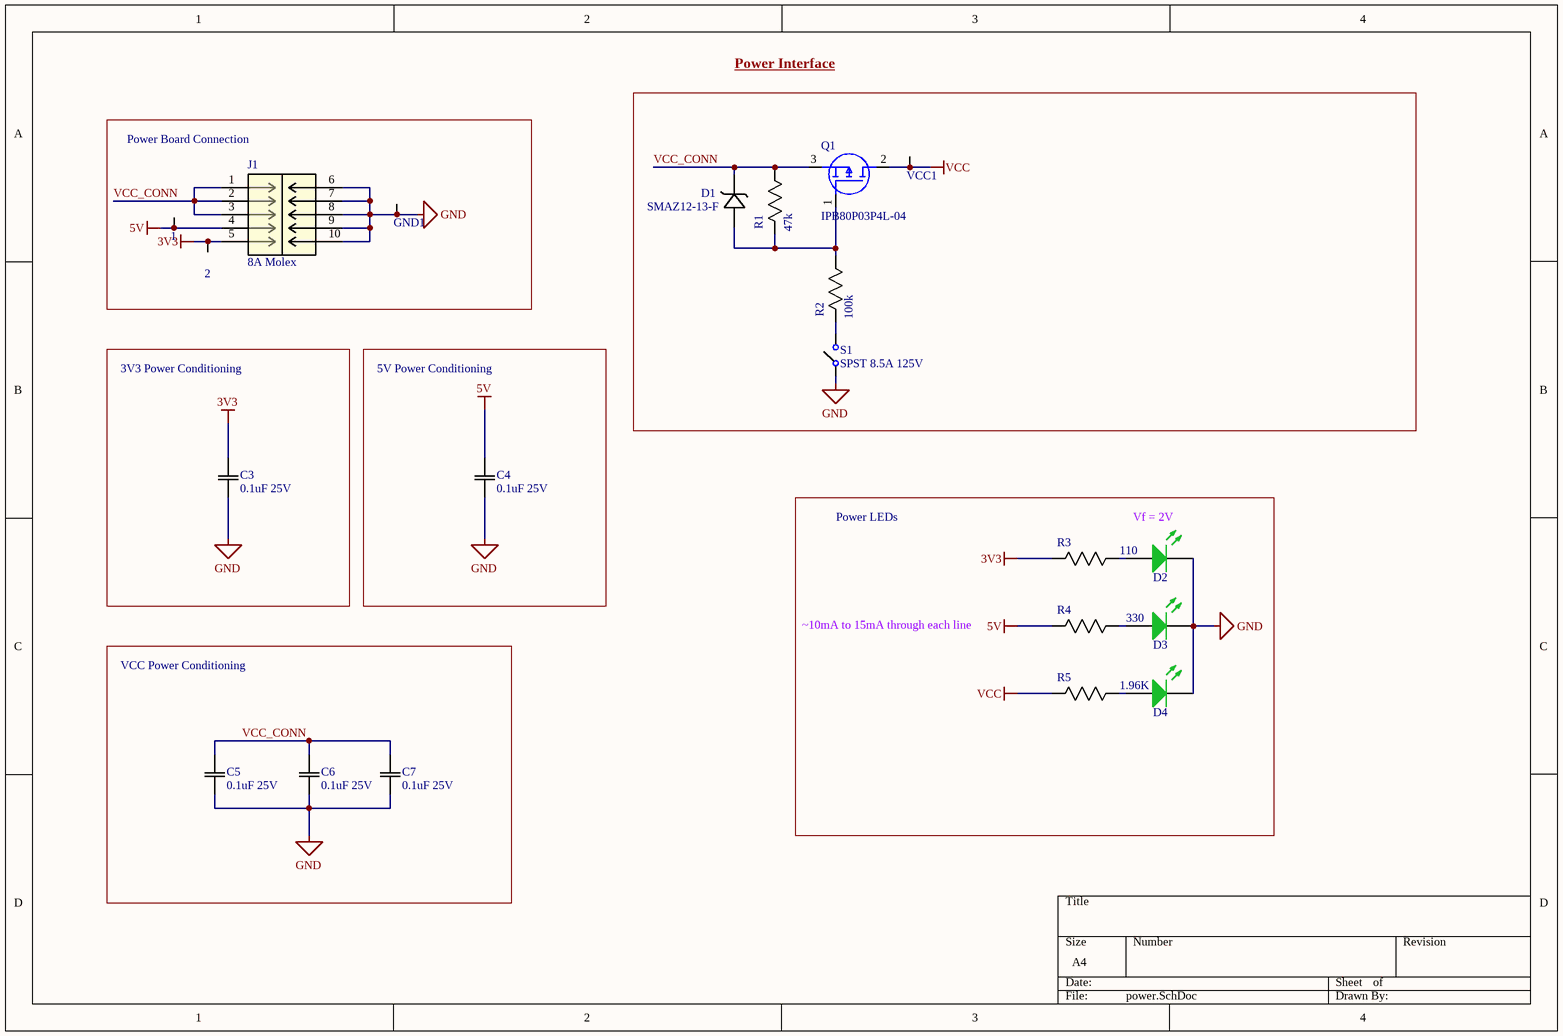
[diagram p5: power.SchDoc]

### Parts
1  Test Point (Via)  [TP]  (value not drawn)
2  Test Point (Via)  [TP]  (value not drawn)
C3  0.1uF 25V  [0805]
C4  0.1uF 25V  [0805]
C5  0.1uF 25V  [0805]
C6  0.1uF 25V  [0805]
C7  0.1uF 25V  [0805]
D1  SMAZ12-13-F  [SMA_DIO-L]
D2  LED2  [3.2X1.6X1.1]  (value not drawn)
D3  LED2  [3.2X1.6X1.1]  (value not drawn)
D4  LED2  [3.2X1.6X1.1]  (value not drawn)
GND1  Test Point (Via)  [TP]  (value not drawn)
J1  8A Molex  [MOLEX_0430451012]
Q1  IPB80P03P4L-04  [IPB80P03P4L04]
R1  47k  [0603]
R2  100k  [0603]
R3  110  [0603]
R4  330  [0603]
R5  1.96K  [0603]
S1  SPST 8.5A 125V  [SPST GF-123-0054]
VCC1  Test Point (Via)  [TP]  (value not drawn)

### Blocks framed on the sheet
Power Board Connection: 1 2 GND1 J1
3V3 Power Conditioning: C3
5V Power Conditioning: C4
VCC Power Conditioning: C5-C7

### Nets
3V3: 2.1 C3.1(C1) J1.5 R3.2(R2)
5V: 1.1 C4.1(C1) J1.4 R4.2(R2)
GND: C3.2(C2) C4.2(C2) C5.2(C2) C6.2(C2) C7.2(C2) D2.2(K) D3.2(K) D4.2(K) GND1.1 J1.6 J1.7 J1.8 J1.9 J1.10 S1.0
VCC: Q1.2(D) R5.2(R2) VCC1.1
VCC_CONN: C5.1(C1) C6.1(C1) C7.1(C1) D1.1 J1.1 J1.2 J1.3 Q1.3(S) R1.1(R1)
NetD1_2: D1.2 Q1.1(G) R1.2(R2) R2.1(R1)
NetD2_1: D2.1(A) R3.1(R1)
NetD3_1: D3.1(A) R4.1(R1)
NetD4_1: D4.1(A) R5.1(R1)
NetR2_2: R2.2(R2) S1.1

### Notes on the sheet
- Power Interface
- Power LEDs
- Vf = 2V
- ~10mA to 15mA through each line

### Library data of the parts
C3-C7 = CAP 0.1uF 25V: as C1 on sheet jetson-nano; Value: 0.1uF; Temperature Coefficient: X7R; Rating: 25V; Operating Temperature: -55°C ~ 125°C
D1 = DIODE ZENER 12V 1W: Zener Diode 12 V 1 W ±5% Surface Mount SMA; Mfr_Name: Diodes Inc; Type: DEV; Copyright: Copyright (C) 2021 Ultra Librarian. All rights reserved.; Manufacturer_Part_Number: SMAZ12-13-F; Digi-Key_Part_Number_1: SMAZ12-FDICT-ND; Digi-Key_Part_Number_2: SMAZ12-FDIDKR-ND; Digi-Key_Part_Number_3: SMAZ12-FDITR-ND; RefDes: RefDes; Supplier 1: Mouser; Supplier 2: Newark; Supplier 3: Digi-Key; Supplier Part Number 1: 621-SMAZ12-F; Supplier Part Number 2: 23T8541; Supplier Part Number 3: SMAZ12-FDICT-ND
D2-D4 = LED GREEN SMD: Typical RED, GREEN, YELLOW, AMBER GaAs LED; Voltage - Forward (Vf) (Typ): 2V; Lens Transparency: Clear; Current - Test: 20mA; Package: 1206; Color: Green
J1 = CN HDR 10POS MOLEX 0430451012: CONN HEADER VERT 10POS 3MM; Number of Terminals/Pins: 10; Contact Resistance: 10mR; Connector Type: Male Pin; Number of Ports: 1; Max Voltage Rating (AC): 250V; Pitch: 0.118inch; Supplier 1: Digi-Key; Manufacturer: Molex; Manufacturer Part Number: 0430451012; RoHS: Yes; Category: Headers and Wire Housings; Stock 1: 22123; Pricing 1: 1=2.46000, 10=2.09300, 80=1.72925, 1224=1.36521, 6120=1.21049 (USD); Mount: Through Hole; Color: Black; Contact Material: Brass; Contact Plating: Tin; Housing Color: Black; Housing Material: Polymer; Min Operating Temperature: -40°C; Max Operating Temperature: 105°C; Packaging: Tray; Number of Rows: 2; Number of Positions: 10; Termination: Solder; Number of Contacts: 10; Orientation: Straight; Series: Micro-Fit 3.0™ 43045; Fastening Type: Ramp; Contact Type: Male Pin; Length: 19.15mm; Row Spacing: 0.118inch; Depth: 8.77mm; Flammability Rating: UL94 V-0; RoHS Compliant: Yes; ComponentLink1URL: http://components.arrow.com/part/dataview/0323_01052363?src-supplier=Arrow+Europe; ComponentLink1Description: http://components.arrow.com/part/dataview/0323_01052363?src-supplier=Arrow+Europe; ComponentLink2URL: http://components.arrow.com/part/dataview/2943140S3689940N3303?src-supplier=Arrow+Electronics; ComponentLink2Description: http://components.arrow.com/part/dataview/2943140S3689940N3303?src-supplier=Arrow+Electronics; Supplier Part Number 1: WM1793-ND
Q1 = MOSFET IPB80P03P4L-04: P-Channel 30 V 80A (Tc) 137W (Tc) Surface Mount PG-TO263-3-2; Manufacturer_Name: Infineon; Datasheet Link: https://componentsearchengine.com//IPB80P03P4L-04.pdf; Height: 4.5mm; Manufacturer_Part_Number: IPB80P03P4L-04; Mouser Part Number: 726-IPB80P03P4L-04; Mouser Price/Stock: https://www.mouser.co.uk/ProductDetail/Infineon-Technologies/IPB80P03P4L-04?qs=wK%252BoHS4yu562EimsoDeBJQ%3D%3D; Supplier 1: Mouser; Supplier Part Number 1: 726-IPB80P03P4L-04
R1 = RES 47k 1/8W - 5%: RES SMD 47k OHM 5% 1/8W 0805; Power (Watts): 0.125W; Package: 0805; Value: 47k; Tolerance: 5%
R2 = RES 100k 1/8W - 5%: RES SMD 100K OHM 5% 1/8W 0805/0603; Power (Watts): 0.125W; Package: 0805; Value: 100k; Tolerance: 5%
R3 = RES 110.0 1/8W - 1%: RES SMD 110 OHM 1% 1/8W 0805/0603; Power (Watts): 0.125W; Package: 0805; Value: 110; Tolerance: 1%
R4 = RES 330.0 1/8W - 5%: RES SMD 330 OHM 5% 1/8W 0805; Power (Watts): 0.125W; Package: 0805; Value: 330; Tolerance: 5%
R5 = RES 1.96k 1/8W: RES SMD 1.96K OHM 1% 1/8W 0805; Power (Watts): 0.125W; Package: 0805; Value: 1.96k; Tolerance: 1%
S1 = SW SLIDE: SWITCH SLIDE SPST 8.5A 125V; MP: GF-123-0054; MF: CW Industries; Digikey: CWI333-ND; Digikey Link: https://www.digikey.com/en/products/detail/cw-industries/GF-123-0054/4089770; Price: 1.25 CAD; Rating: 8.5A 125V; ComponentLink1Description: Digikey; ComponentLink1URL: https://www.digikey.ca/product-detail/en/zf-electronics/SRB22A2FBBNN/CH755-ND/446021; ComponentLink2Description: Datasheet; ComponentLink2URL: http://switches-sensors.zf.com/us/wp-content/uploads/sites/7/2012/10/Rocker_SRB_Datasheet1.pdf

## Sheet ui.SchDoc
size A4; SheetNumber: 6; SheetTotal: 8
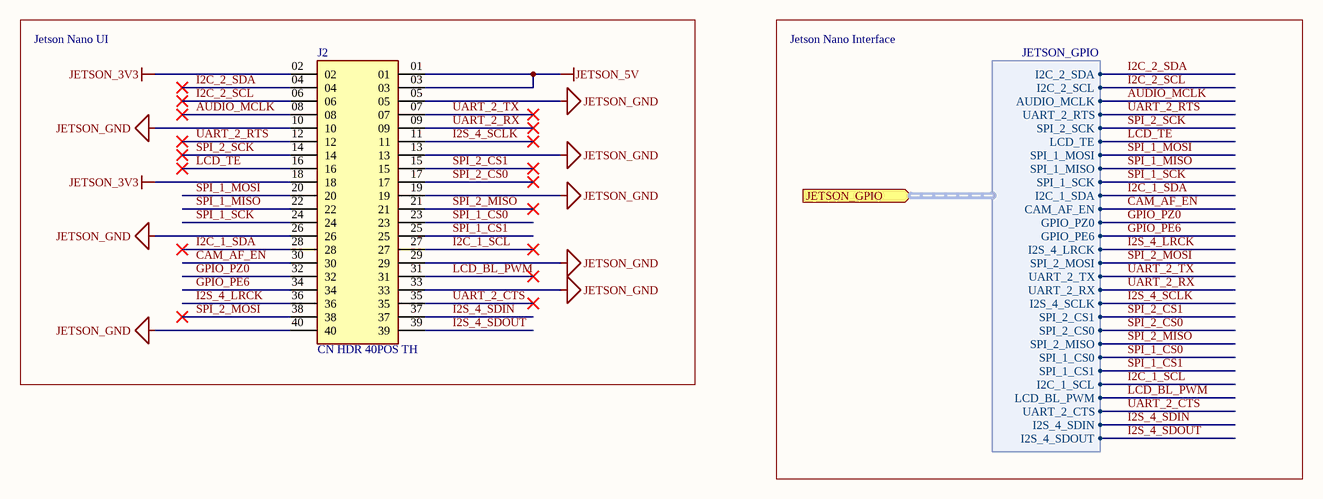
[diagram p6: ui.SchDoc]

### Parts
J2  CN HDR 40POS TH  [SAMTEC_SSQ-120-22-G-D]

### Blocks framed on the sheet
Jetson Nano UI: J2

### Ports
JETSON_GPIO (in, harness JETSON_GPIO)

### Harnesses
JETSON_GPIO: I2C_2_SDA, I2C_2_SCL, AUDIO_MCLK, UART_2_RTS, SPI_2_SCK, LCD_TE, SPI_1_MOSI, SPI_1_MISO, SPI_1_SCK, I2C_1_SDA, CAM_AF_EN, GPIO_PZ0, GPIO_PE6, I2S_4_LRCK, SPI_2_MOSI, UART_2_TX, UART_2_RX, I2S_4_SCLK, SPI_2_CS1, SPI_2_CS0, SPI_2_MISO, SPI_1_CS0, SPI_1_CS1, I2C_1_SCL, LCD_BL_PWM, UART_2_CTS, I2S_4_SDIN, I2S_4_SDOUT

### Nets
JETSON_3V3: J2.02 J2.18
JETSON_5V: J2.01 J2.03
JETSON_GND: J2.05 J2.10 J2.13 J2.19 J2.26 J2.29 J2.33 J2.40
AUDIO_MCLK: J2.08 ; port JETSON_GPIO.AUDIO_MCLK
CAM_AF_EN: J2.30 ; port JETSON_GPIO.CAM_AF_EN
GPIO_PE6: J2.34 ; port JETSON_GPIO.GPIO_PE6
GPIO_PZ0: J2.32 ; port JETSON_GPIO.GPIO_PZ0
I2C_1_SCL: J2.27 ; port JETSON_GPIO.I2C_1_SCL
I2C_1_SDA: J2.28 ; port JETSON_GPIO.I2C_1_SDA
I2C_2_SCL: J2.06 ; port JETSON_GPIO.I2C_2_SCL
I2C_2_SDA: J2.04 ; port JETSON_GPIO.I2C_2_SDA
I2S_4_LRCK: J2.36 ; port JETSON_GPIO.I2S_4_LRCK
I2S_4_SCLK: J2.11 ; port JETSON_GPIO.I2S_4_SCLK
I2S_4_SDIN: J2.37 ; port JETSON_GPIO.I2S_4_SDIN
I2S_4_SDOUT: J2.39 ; port JETSON_GPIO.I2S_4_SDOUT  [project net CTRL_EN]
LCD_BL_PWM: J2.31 ; port JETSON_GPIO.LCD_BL_PWM
LCD_TE: J2.16 ; port JETSON_GPIO.LCD_TE
SPI_1_CS0: J2.23 ; port JETSON_GPIO.SPI_1_CS0
SPI_1_CS1: J2.25 ; port JETSON_GPIO.SPI_1_CS1
SPI_1_MISO: J2.22 ; port JETSON_GPIO.SPI_1_MISO
SPI_1_MOSI: J2.20 ; port JETSON_GPIO.SPI_1_MOSI
SPI_1_SCK: J2.24 ; port JETSON_GPIO.SPI_1_SCK
SPI_2_CS0: J2.17 ; port JETSON_GPIO.SPI_2_CS0
SPI_2_CS1: J2.15 ; port JETSON_GPIO.SPI_2_CS1
SPI_2_MISO: J2.21 ; port JETSON_GPIO.SPI_2_MISO
SPI_2_MOSI: J2.38 ; port JETSON_GPIO.SPI_2_MOSI
SPI_2_SCK: J2.14 ; port JETSON_GPIO.SPI_2_SCK
UART_2_CTS: J2.35 ; port JETSON_GPIO.UART_2_CTS
UART_2_RTS: J2.12 ; port JETSON_GPIO.UART_2_RTS
UART_2_RX: J2.09 ; port JETSON_GPIO.UART_2_RX
UART_2_TX: J2.07 ; port JETSON_GPIO.UART_2_TX

### Notes on the sheet
- Jetson Nano Interface

### Library data of the parts
J2 = CN HDR 40POS TH: SSQ - Samtec 2.54mm Square Tail Dual Row Socket Strip 8.5mm Profile; MP: SSQ-120-22-G-D; Value: *; Price: None; Package: None; MF: Samtec; Check_prices: https://www.snapeda.com/parts/SSQ-120-22-G-D/Samtec/view-part/3393219/?ref=eda; Availability: In Stock; SnapEDA_Link: https://www.snapeda.com/parts/SSQ-120-22-G-D/Samtec/view-part/3393219/?ref=snap; Purchase-URL: https://pricing.snapeda.com/search/part/SSQ-120-22-G-D/?ref=eda; Digikey: S6104-ND

## Sheet bob_encoder.SchDoc
size A4; SheetNumber: 8; SheetTotal: 8
Used 5 times, as channels U_bob_encoder_0, U_bob_encoder_1, U_bob_encoder_2, U_bob_encoder_3, U_bob_encoder_4. Parts and nets are listed once, with the designators drawn on the sheet.
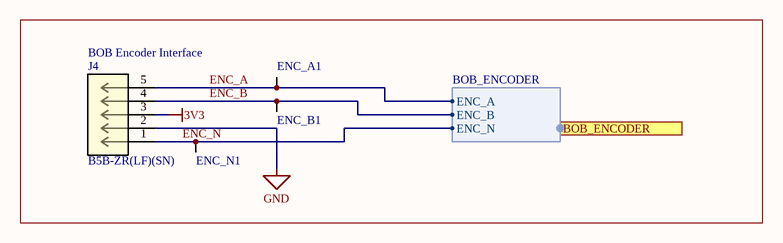
[diagram p7: bob_encoder.SchDoc]

### Parts
ENC_A1  Test Point (Via)  [TP]  (value not drawn)
ENC_B1  Test Point (Via)  [TP]  (value not drawn)
ENC_N1  Test Point (Via)  [TP]  (value not drawn)
J4  B5B-ZR(LF)(SN)  [JST_B5B-ZR(LF)(SN)]

### Blocks framed on the sheet
BOB Encoder Interface: ENC_A1 ENC_B1 ENC_N1 J4

### Ports
BOB_ENCODER (harness BOB_ENCODER)

### Harnesses
BOB_ENCODER: ENC_A, ENC_B, ENC_N

### Nets
3V3: J4.3
GND: J4.2
ENC_A: ENC_A1.1 J4.5 ; port BOB_ENCODER.ENC_A
ENC_B: ENC_B1.1 J4.4 ; port BOB_ENCODER.ENC_B
ENC_N: ENC_N1.1 J4.1 ; port BOB_ENCODER.ENC_N

### Channels
U_bob_encoder_0: designators end in _1
U_bob_encoder_1: designators end in _2
U_bob_encoder_2: designators end in _3
U_bob_encoder_3: designators end in _4
U_bob_encoder_4: designators end in _5

### Library data of the parts
J4 = CN 5POS JST ZR: Connector Header Through Hole 5 position 0.059 (1.50mm); MF: JST Sales; Package: None; Check_prices: https://www.snapeda.com/parts/B5B-ZR(LF)(SN)/JST%20Sales%20America%20Inc./view-part/214617/?ref=eda; Purchase-URL: https://pricing.snapeda.com/search/part/B5B-ZR(LF)(SN)/?ref=eda; Price: None; MP: B5B-ZR(LF)(SN); Value: *; Availability: Warning; SnapEDA_Link: https://www.snapeda.com/parts/B5B-ZR(LF)(SN)/JST%20Sales%20America%20Inc./view-part/214617/?ref=snap; Supplier 1: Digi-Key; Supplier 2: Future Electronics; Supplier Part Number 1: 455-1660-ND; Supplier Part Number 2: 5800651

## Nets that join several sheets
3V3: jetson-nano (5 pins), U_jetson-nano/U_isolation_0 (C9_1.2 U6_1.16), U_jetson-nano/U_isolation_1 (C9_2.2 U6_2.16), U_jetson-nano/U_isolation_2 (C9_3.2 U6_3.16), U_bob_0 (P2_1.2), U_bob_1 (P2_2.2), U_bob_2 (P2_3.2), U_bob_3 (P2_4.2), U_bob_4 (P2_5.2), power (2.1 C3.1 J1.5 R3.2), U_bob_encoder_0 (J4_1.3), U_bob_encoder_1 (J4_2.3), U_bob_encoder_2 (J4_3.3), U_bob_encoder_3 (J4_4.3), U_bob_encoder_4 (J4_5.3)
5V: U_bob_0 (P2_1.1), U_bob_1 (P2_2.1), U_bob_2 (P2_3.1), U_bob_3 (P2_4.1), U_bob_4 (P2_5.1), power (1.1 C4.1 J1.4 R4.2)
GND: jetson-nano (24 pins), U_jetson-nano/U_isolation_0 (C9_1.1 R7_1.2 U6_1.9 U6_1.15), U_jetson-nano/U_isolation_1 (C9_2.1 R7_2.2 U6_2.9 U6_2.15), U_jetson-nano/U_isolation_2 (C9_3.1 R7_3.2 U6_3.9 U6_3.15), U_jetson-nano/U_low-pass-filter_3 (R10_4.2), U_bob_0 (P2_1.3 P2_1.18 P2_1.19 P2_1.20), U_bob_1 (P2_2.3 P2_2.18 P2_2.19 P2_2.20), U_bob_2 (P2_3.3 P2_3.18 P2_3.19 P2_3.20), U_bob_3 (P2_4.3 P2_4.18 P2_4.19 P2_4.20), U_bob_4 (P2_5.3 P2_5.18 P2_5.19 P2_5.20), power (15 pins), U_bob_encoder_0 (J4_1.2), U_bob_encoder_1 (J4_2.2), U_bob_encoder_2 (J4_3.2), U_bob_encoder_3 (J4_4.2), U_bob_encoder_4 (J4_5.2)
JETSON_3V3: jetson-nano (C2.1), U_jetson-nano/U_isolation_0 (C8_1.2 U6_1.1), U_jetson-nano/U_isolation_1 (C8_2.2 U6_2.1), U_jetson-nano/U_isolation_2 (C8_3.2 U6_3.1), ui (J2.02 J2.18)
JETSON_5V: jetson-nano (C1.1), ui (J2.01 J2.03)
JETSON_GND: jetson-nano (C1.2 C2.2), U_jetson-nano/U_isolation_0 (C8_1.1 R6_1.2 U6_1.2 U6_1.8), U_jetson-nano/U_isolation_1 (C8_2.1 R6_2.2 U6_2.2 U6_2.8), U_jetson-nano/U_isolation_2 (C8_3.1 R6_3.2 U6_3.2 U6_3.8), U_jetson-nano/U_low-pass-filter_0 (R10_1.2), U_jetson-nano/U_low-pass-filter_1 (R10_2.2), U_jetson-nano/U_low-pass-filter_2 (R10_3.2), U_jetson-nano/U_low-pass-filter_4 (R10_5.2), U_jetson-nano/U_low-pass-filter_5 (R10_6.2), U_jetson-nano/U_low-pass-filter_6 (R10_7.2), U_jetson-nano/U_low-pass-filter_7 (R10_8.2), U_jetson-nano/U_low-pass-filter_8 (R10_9.2), U_jetson-nano/U_low-pass-filter_9 (R10_10.2), ui (8 pins)
VCC: U_bob_0 (P2_1.16 P2_1.17), U_bob_1 (P2_2.16 P2_2.17), U_bob_2 (P2_3.16 P2_3.17), U_bob_3 (P2_4.16 P2_4.17), U_bob_4 (P2_5.16 P2_5.17), power (Q1.2 R5.2 VCC1.1)
CAM_AF_EN: U_jetson-nano/U_low-pass-filter_6 (R8_7.2), ui (J2.30)
CTRL_EN: U_bob_0 (P2_1.30), U_bob_1 (P2_2.30), U_bob_2 (P2_3.30), U_bob_3 (P2_4.30), U_bob_4 (P2_5.30), ui (J2.39)
ENC_A: U_bob_0 (P2_1.7), U_bob_encoder_0 (ENC_A1_1.1 J4_1.5)
ENC_A: U_bob_1 (P2_2.7), U_bob_encoder_1 (ENC_A1_2.1 J4_2.5)
ENC_A: U_bob_2 (P2_3.7), U_bob_encoder_2 (ENC_A1_3.1 J4_3.5)
ENC_A: U_bob_3 (P2_4.7), U_bob_encoder_3 (ENC_A1_4.1 J4_4.5)
ENC_A: U_bob_4 (P2_5.7), U_bob_encoder_4 (ENC_A1_5.1 J4_5.5)
ENC_B: U_bob_0 (P2_1.6), U_bob_encoder_0 (ENC_B1_1.1 J4_1.4)
ENC_B: U_bob_1 (P2_2.6), U_bob_encoder_1 (ENC_B1_2.1 J4_2.4)
ENC_B: U_bob_2 (P2_3.6), U_bob_encoder_2 (ENC_B1_3.1 J4_3.4)
ENC_B: U_bob_3 (P2_4.6), U_bob_encoder_3 (ENC_B1_4.1 J4_4.4)
ENC_B: U_bob_4 (P2_5.6), U_bob_encoder_4 (ENC_B1_5.1 J4_5.4)
ENC_N: U_bob_0 (P2_1.5), U_bob_encoder_0 (ENC_N1_1.1 J4_1.1)
ENC_N: U_bob_1 (P2_2.5), U_bob_encoder_1 (ENC_N1_2.1 J4_2.1)
ENC_N: U_bob_2 (P2_3.5), U_bob_encoder_2 (ENC_N1_3.1 J4_3.1)
ENC_N: U_bob_3 (P2_4.5), U_bob_encoder_3 (ENC_N1_4.1 J4_4.1)
ENC_N: U_bob_4 (P2_5.5), U_bob_encoder_4 (ENC_N1_5.1 J4_5.1)
GPIO_PE6: U_jetson-nano/U_low-pass-filter_8 (R8_9.2), ui (J2.34)
GPIO_PZ0: U_jetson-nano/U_low-pass-filter_7 (R8_8.2), ui (J2.32)
I2S_4_LRCK: U_jetson-nano/U_low-pass-filter_0 (R8_1.2), ui (J2.36)
I2S_4_SDIN: U_jetson-nano/U_low-pass-filter_9 (R8_10.2), ui (J2.37)
SPI_1_CS0: U_jetson-nano/U_low-pass-filter_4 (R8_5.2), ui (J2.23)
SPI_1_CS0_CTRL: jetson-nano (U1.7), U_bob_0 (P2_1.11)
SPI_1_CS0_DRV: jetson-nano (U1.6), U_bob_0 (P2_1.12)
SPI_1_CS0_FILTER: U_jetson-nano/U_isolation_1 (U6_2.3), U_jetson-nano/U_low-pass-filter_4 (R9_5.1 R10_5.1)
SPI_1_CS0_ISO: jetson-nano (P1.11 U1.1), U_jetson-nano/U_isolation_1 (U6_2.14)
SPI_1_CS1: U_jetson-nano/U_low-pass-filter_5 (R8_6.2), ui (J2.25)
SPI_1_CS1_CTRL: jetson-nano (U2.7), U_bob_1 (P2_2.11)
SPI_1_CS1_DRV: jetson-nano (U2.6), U_bob_1 (P2_2.12)
SPI_1_CS1_FILTER: U_jetson-nano/U_isolation_1 (U6_2.4), U_jetson-nano/U_low-pass-filter_5 (R9_6.1 R10_6.1)
SPI_1_CS1_ISO: jetson-nano (P1.9 U2.1), U_jetson-nano/U_isolation_1 (U6_2.13)
SPI_1_CS2_CTRL: jetson-nano (U3.7), U_bob_2 (P2_3.11)
SPI_1_CS2_DRV: jetson-nano (U3.6), U_bob_2 (P2_3.12)
SPI_1_CS2_FILTER: U_jetson-nano/U_isolation_1 (U6_2.5), U_jetson-nano/U_low-pass-filter_6 (R9_7.1 R10_7.1)
SPI_1_CS2_ISO: jetson-nano (P1.7 U3.1), U_jetson-nano/U_isolation_1 (U6_2.12)
SPI_1_CS3_CTRL: jetson-nano (U4.7), U_bob_3 (P2_4.11)
SPI_1_CS3_DRV: jetson-nano (U4.6), U_bob_3 (P2_4.12)
SPI_1_CS3_FILTER: U_jetson-nano/U_isolation_2 (U6_3.4), U_jetson-nano/U_low-pass-filter_7 (R9_8.1 R10_8.1)
SPI_1_CS3_ISO: jetson-nano (P1.5 U4.1), U_jetson-nano/U_isolation_2 (U6_3.13)
SPI_1_CS4_CTRL: jetson-nano (U5.7), U_bob_4 (P2_5.11)
SPI_1_CS4_DRV: jetson-nano (U5.6), U_bob_4 (P2_5.12)
SPI_1_CS4_FILTER: U_jetson-nano/U_isolation_2 (U6_3.3), U_jetson-nano/U_low-pass-filter_8 (R9_9.1 R10_9.1)
SPI_1_CS4_ISO: jetson-nano (P1.3 U5.1), U_jetson-nano/U_isolation_2 (U6_3.14)
SPI_1_CS5_FILTER: U_jetson-nano/U_isolation_0 (U6_1.3), U_jetson-nano/U_low-pass-filter_0 (R9_1.1 R10_1.1)
SPI_1_CS5_ISO: jetson-nano (CS5.1), U_jetson-nano/U_isolation_0 (U6_1.14)
SPI_1_MISO: U_jetson-nano/U_isolation_0 (U6_1.6), ui (J2.22)
SPI_1_MISO_FILTER: jetson-nano (P1.13), U_jetson-nano/U_isolation_0 (U6_1.11), U_jetson-nano/U_low-pass-filter_3 (R9_4.1 R10_4.1)
SPI_1_MISO_ISO: U_jetson-nano/U_low-pass-filter_3 (R8_4.2), U_bob_0 (P2_1.15), U_bob_1 (P2_2.15), U_bob_2 (P2_3.15), U_bob_3 (P2_4.15), U_bob_4 (P2_5.15)
SPI_1_MOSI: U_jetson-nano/U_low-pass-filter_2 (R8_3.2), ui (J2.20)
SPI_1_MOSI_FILTER: U_jetson-nano/U_isolation_0 (U6_1.5), U_jetson-nano/U_low-pass-filter_2 (R9_3.1 R10_3.1)
SPI_1_MOSI_ISO: jetson-nano (P1.15), U_jetson-nano/U_isolation_0 (U6_1.12), U_bob_0 (P2_1.14), U_bob_1 (P2_2.14), U_bob_2 (P2_3.14), U_bob_3 (P2_4.14), U_bob_4 (P2_5.14)
SPI_1_MUX_SEL_FILTER: U_jetson-nano/U_isolation_2 (U6_3.5), U_jetson-nano/U_low-pass-filter_9 (R9_10.1 R10_10.1)
SPI_1_MUX_SEL_ISO: jetson-nano (6 pins), U_jetson-nano/U_isolation_2 (U6_3.12)
SPI_1_SCK: U_jetson-nano/U_low-pass-filter_1 (R8_2.2), ui (J2.24)
SPI_1_SCK_FILTER: U_jetson-nano/U_isolation_0 (U6_1.4), U_jetson-nano/U_low-pass-filter_1 (R9_2.1 R10_2.1)
SPI_1_SCK_ISO: jetson-nano (P1.17), U_jetson-nano/U_isolation_0 (U6_1.13), U_bob_0 (P2_1.13), U_bob_1 (P2_2.13), U_bob_2 (P2_3.13), U_bob_3 (P2_4.13), U_bob_4 (P2_5.13)